# Altium schematic sheet Block.SchDoc: Title
size A3; Date: Date; CompanyName: Integrated Micro-Electronics Bulgaria; Organization: Design & Development Department; Address1: Drawing Type; Address2: Address 1; Address3: Address 2; Address4: Address 3; DocumentNumber: 730xxx; Revision: 01; SheetNumber: 1; SheetTotal: 1; PageSetup: Record=PageOptions|CenterHorizontal=True|CenterVertical=True|PrintScale=0.70|XCorrection=1.00|YCorrection=1.00|PrintKind=2|BorderSize=5000000|LeftOffset=0|BottomOffset=0|Orientation=2|PaperLength=1000|PaperWidth=1000|Scale=100|PaperSource=7|PrintQuality=-4|MediaType=1|DitherType=10|PaperKind=A4|PrintScaleMode=1; SheetSize: A3; Time: Time; ModifiedDate: Mod. Date
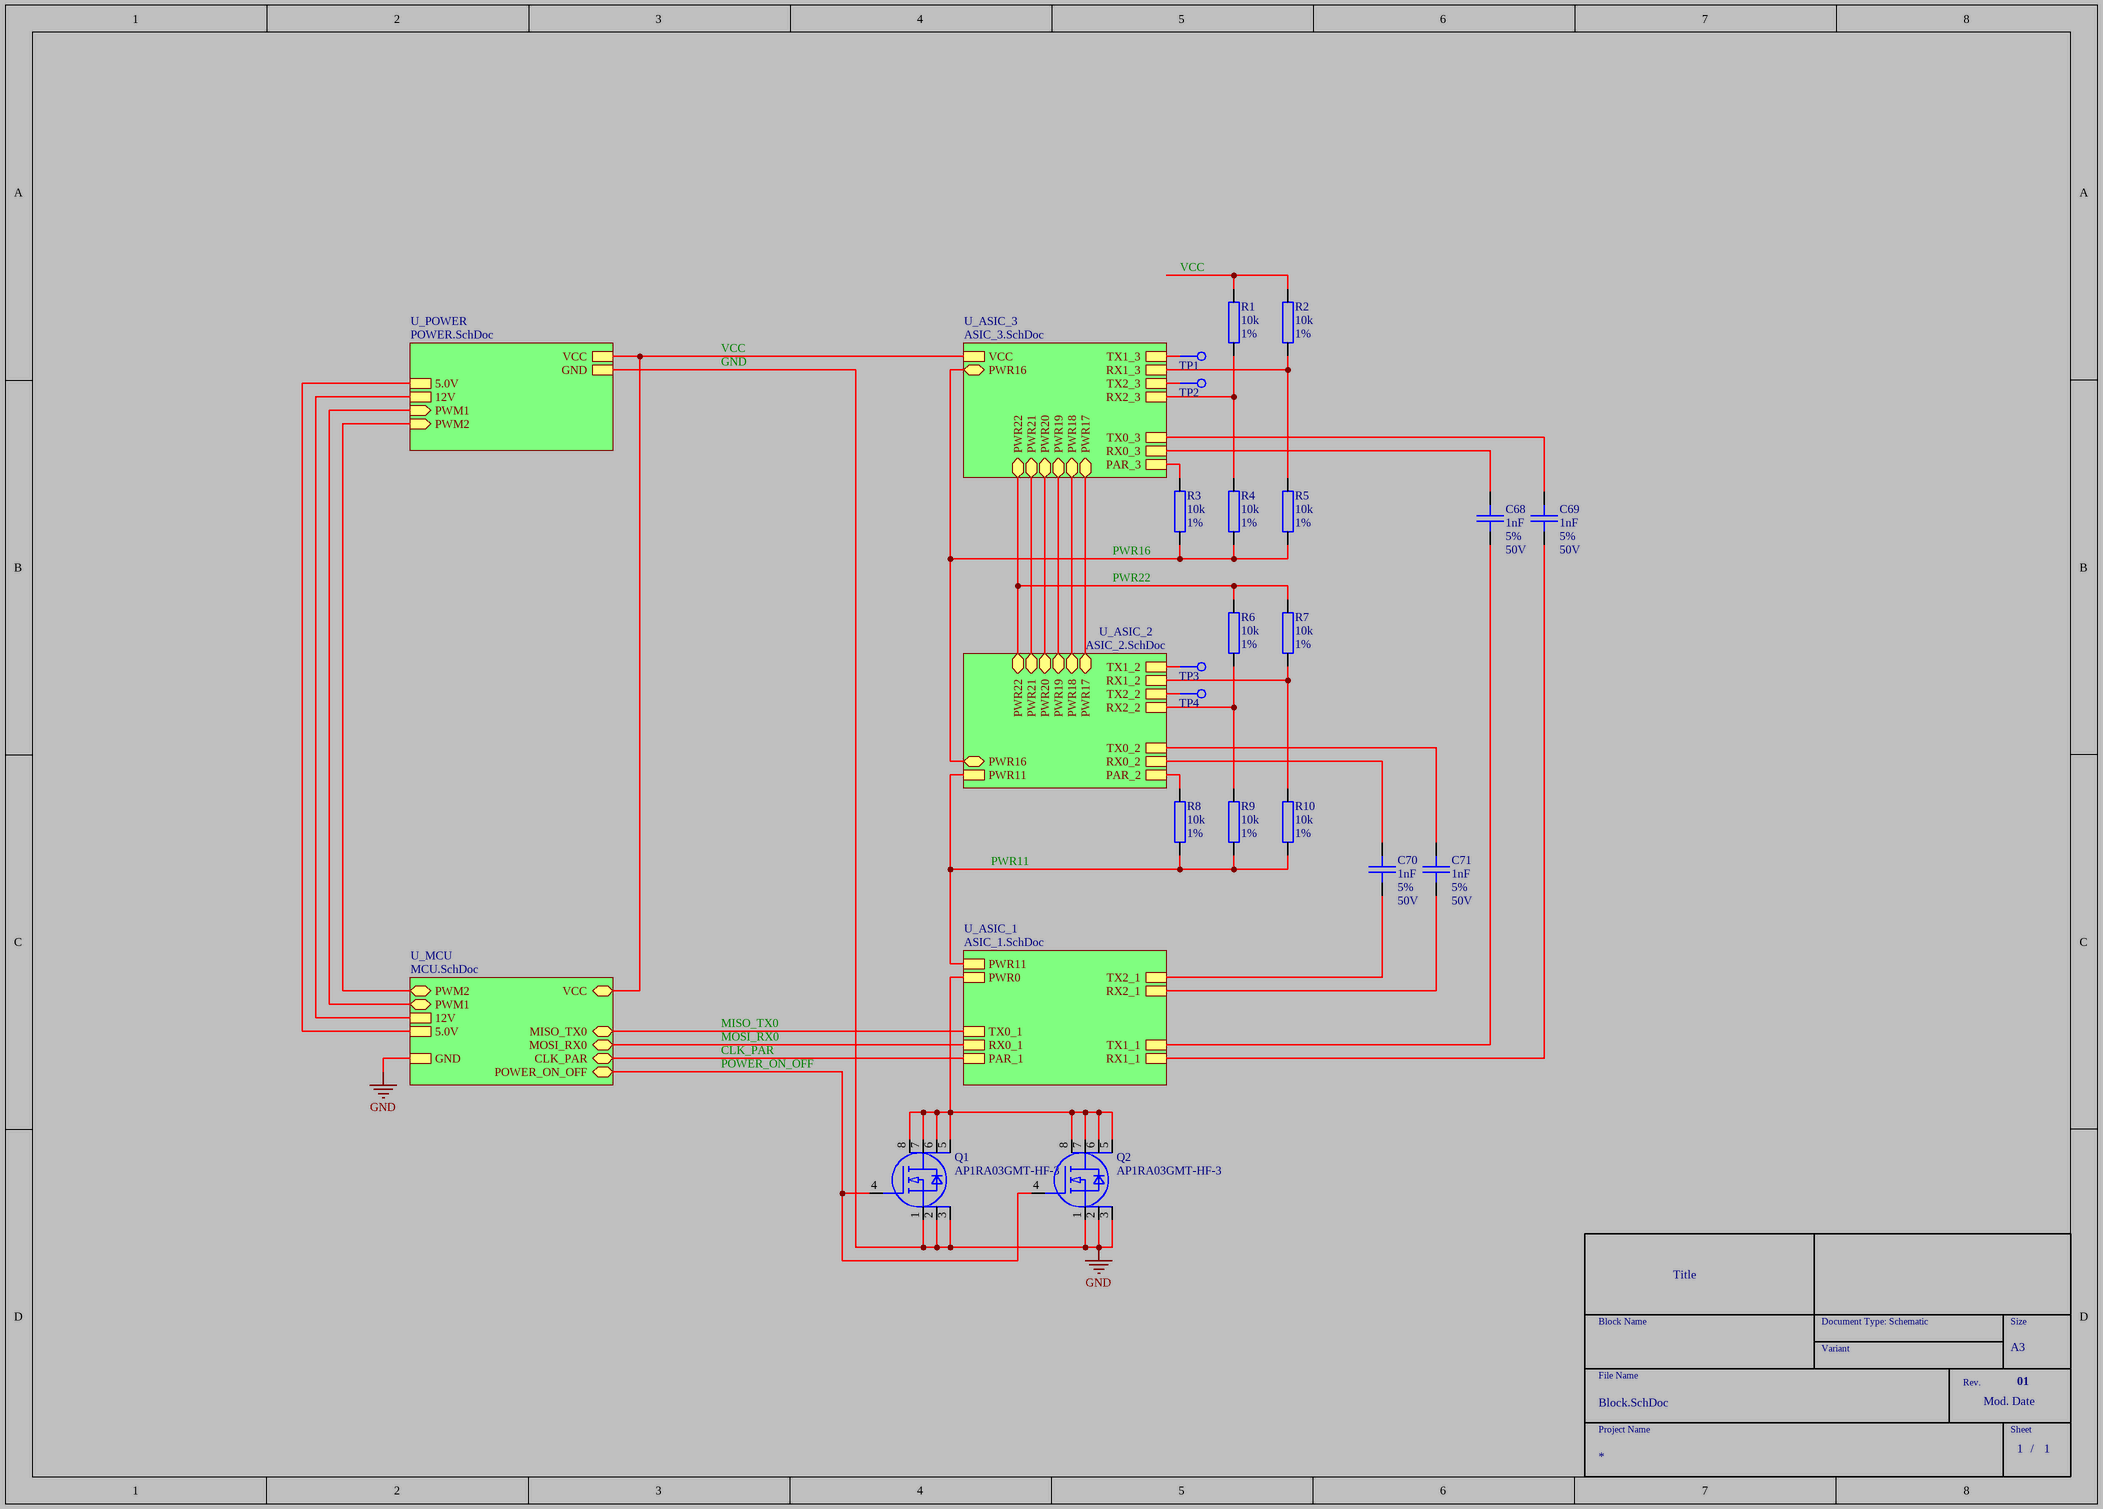
[diagram p0: Block.SchDoc]

## Parts
C68  DB_VALUE: 1nF  DB_TOLERANCE: 5%  DB_VOLTAGE: 50V  [SMD_0603_CAPC1608X95N]  (hidden comment: C)
C69  DB_VALUE: 1nF  DB_TOLERANCE: 5%  DB_VOLTAGE: 50V  [SMD_0603_CAPC1608X95N]  (hidden comment: C)
C70  DB_VALUE: 1nF  DB_TOLERANCE: 5%  DB_VOLTAGE: 50V  [SMD_0603_CAPC1608X95N]  (hidden comment: C)
C71  DB_VALUE: 1nF  DB_TOLERANCE: 5%  DB_VOLTAGE: 50V  [SMD_0603_CAPC1608X95N]  (hidden comment: C)
Q1  DB_VALUE: AP1RA03GMT-HF-3  [SMD_SOIC127P600X110-9AN]  (hidden comment: MOS_N_D1_S1S2S3G4D5D6D7D8)
Q2  DB_VALUE: AP1RA03GMT-HF-3  [SMD_SOIC127P600X110-9AN]  (hidden comment: MOS_N_D1_S1S2S3G4D5D6D7D8)
R1  DB_VALUE: 10k  DB_TOLERANCE: 1%  [SMD_0603_RESC1608X55N]  (hidden comment: R)
R2  DB_VALUE: 10k  DB_TOLERANCE: 1%  [SMD_0603_RESC1608X55N]  (hidden comment: R)
R3  DB_VALUE: 10k  DB_TOLERANCE: 1%  [SMD_0603_RESC1608X55N]  (hidden comment: R)
R4  DB_VALUE: 10k  DB_TOLERANCE: 1%  [SMD_0603_RESC1608X55N]  (hidden comment: R)
R5  DB_VALUE: 10k  DB_TOLERANCE: 1%  [SMD_0603_RESC1608X55N]  (hidden comment: R)
R6  DB_VALUE: 10k  DB_TOLERANCE: 1%  [SMD_0603_RESC1608X55N]  (hidden comment: R)
R7  DB_VALUE: 10k  DB_TOLERANCE: 1%  [SMD_0603_RESC1608X55N]  (hidden comment: R)
R8  DB_VALUE: 10k  DB_TOLERANCE: 1%  [SMD_0603_RESC1608X55N]  (hidden comment: R)
R9  DB_VALUE: 10k  DB_TOLERANCE: 1%  [SMD_0603_RESC1608X55N]  (hidden comment: R)
R10  DB_VALUE: 10k  DB_TOLERANCE: 1%  [SMD_0603_RESC1608X55N]  (hidden comment: R)
TP1  TEST_POINT_1  [SMD_TP_100-254]  (value not drawn)
TP2  TEST_POINT_1  [SMD_TP_100-254]  (value not drawn)
TP3  TEST_POINT_1  [SMD_TP_100-254]  (value not drawn)
TP4  TEST_POINT_1  [SMD_TP_100-254]  (value not drawn)

## Sub-sheets
U_ASIC_1 = ASIC_1.SchDoc: PWR11, PWR0, PAR_1, TX0_1, RX0_1, TX1_1, RX1_1, TX2_1, RX2_1
U_ASIC_2 = ASIC_2.SchDoc: PWR11, PAR_2, TX0_2, RX0_2, TX1_2, RX1_2, TX2_2, RX2_2, PWR16, PWR22, PWR17, PWR18, PWR19, PWR20, PWR21
U_ASIC_3 = ASIC_3.SchDoc: VCC, PAR_3, TX0_3, RX0_3, TX1_3, RX1_3, TX2_3, RX2_3, PWR16, PWR17, PWR18, PWR19, PWR20, PWR21, PWR22
U_MCU = MCU.SchDoc: GND, 12V, 5.0V, MOSI_RX0, MISO_TX0, CLK_PAR, POWER_ON_OFF, PWM1, PWM2, VCC
U_POWER = POWER.SchDoc: VCC, GND, 5.0V, 12V, PWM1 (in), PWM2 (in)

## Nets
GND: Q1.1(S) Q1.2(S) Q1.3(S) Q2.1(S) Q2.2(S) Q2.3(S) ; sheet U_MCU/GND, sheet U_POWER/GND
CLK_PAR: sheet U_MCU/CLK_PAR, sheet U_ASIC_1/PAR_1
MISO_TX0: sheet U_MCU/MISO_TX0, sheet U_ASIC_1/TX0_1
MOSI_RX0: sheet U_MCU/MOSI_RX0, sheet U_ASIC_1/RX0_1
POWER_ON_OFF: Q1.4(G) Q2.4(G) ; sheet U_MCU/POWER_ON_OFF
PWR11: R8.2 R9.2 R10.2 ; sheet U_ASIC_1/PWR11, sheet U_ASIC_2/PWR11
PWR16: R3.2 R4.2 R5.2 ; sheet U_ASIC_2/PWR16, sheet U_ASIC_3/PWR16
PWR22: R6.2 R7.2 ; sheet U_ASIC_2/PWR22, sheet U_ASIC_3/PWR22
VCC: R1.2 R2.2 ; sheet U_MCU/VCC, sheet U_ASIC_3/VCC, sheet U_POWER/VCC
NetC68_1: C68.1 ; sheet U_ASIC_3/RX0_3
NetC68_2: C68.2 ; sheet U_ASIC_1/TX1_1
NetC69_1: C69.1 ; sheet U_ASIC_3/TX0_3
NetC69_2: C69.2 ; sheet U_ASIC_1/RX1_1
NetC70_1: C70.1 ; sheet U_ASIC_2/RX0_2
NetC70_2: C70.2 ; sheet U_ASIC_1/TX2_1
NetC71_1: C71.1 ; sheet U_ASIC_2/TX0_2
NetC71_2: C71.2 ; sheet U_ASIC_1/RX2_1
NetQ1_5: Q1.5(D) Q1.6(D) Q1.7(D) Q1.8(D) Q2.5(D) Q2.6(D) Q2.7(D) Q2.8(D) ; sheet U_ASIC_1/PWR0
NetR1_1: R1.1 R4.1 ; sheet U_ASIC_3/RX2_3
NetR2_1: R2.1 R5.1 ; sheet U_ASIC_3/RX1_3
NetR3_1: R3.1 ; sheet U_ASIC_3/PAR_3
NetR6_1: R6.1 R9.1 ; sheet U_ASIC_2/RX2_2
NetR7_1: R7.1 R10.1 ; sheet U_ASIC_2/RX1_2
NetR8_1: R8.1 ; sheet U_ASIC_2/PAR_2
NetTP1_1: TP1.1 ; sheet U_ASIC_3/TX1_3
NetTP2_1: TP2.1 ; sheet U_ASIC_3/TX2_3
NetTP3_1: TP3.1 ; sheet U_ASIC_2/TX1_2
NetTP4_1: TP4.1 ; sheet U_ASIC_2/TX2_2
(unnamed): sheet U_MCU/12V, sheet U_POWER/12V
(unnamed): sheet U_MCU/5.0V, sheet U_POWER/5.0V
(unnamed): sheet U_MCU/PWM1, sheet U_POWER/PWM1
(unnamed): sheet U_MCU/PWM2, sheet U_POWER/PWM2
(unnamed): sheet U_ASIC_2/PWR17, sheet U_ASIC_3/PWR17
(unnamed): sheet U_ASIC_2/PWR18, sheet U_ASIC_3/PWR18
(unnamed): sheet U_ASIC_2/PWR19, sheet U_ASIC_3/PWR19
(unnamed): sheet U_ASIC_2/PWR20, sheet U_ASIC_3/PWR20
(unnamed): sheet U_ASIC_2/PWR21, sheet U_ASIC_3/PWR21

## Notes on the sheet
- Block Name
- Document Type: Schematic
- Size
- File Name
- Variant
- Rev.
- Project Name
- Sheet
- /

## Library data of the parts
C68-C71 = CAP000020649: DB_PART_TYPE: Ceramic_SMD\Open_Mode_X7R; DB_MANUFACTURER_PART: KEMET    C0603F102J5RAC; NOTE: <NOTE>; DB_T_RANGE: -55 to 125; DB_PACKAGE: 0603; DB_DESCRIPTION: C X7R 1nF 5% 50V 0603; DB_STATUS: NEW; DB_PART_NUMBER: CAP000020649; DB_PCB_DEVICE: SMD_0603_CAPC1608X95N; DB_APPROVED_ON: 09.10.2010; DB_DATASHEET: http://john.epiqdesign.com/projects/CIS_Datasheets/F3102_CE_Kemet.pdf?rev=92&sc=0
Q1 Q2 = TRA000001604: DB_PART_TYPE: MOSFET\N_Channel; DB_MANUFACTURER_PART: ADVANCED POWER ELECTRONICS CORP      AP1RA03GMT-HF-3; NOTE: <NOTE>; DB_T_RANGE: -55 to 150; DB_VOLTAGE: 30V; DB_CURRENT: 185A; DB_PACKAGE: PQFN 5x6B; DB_DESCRIPTION: TRANS AP1RA03GMT-HF-3 PQFN 5x6B; DB_APPROVED_BY: VSN; DB_STATUS: NEW; DB_PART_NUMBER: TRA000001604; DB_PCB_DEVICE: SMD_SOIC127P600X110-9AN; DB_APPROVED_ON: 07.05.2014 12:55:44; DB_DATASHEET: http://john.epiqdesign.com/projects/CIS_Datasheets/MOS_AP1RA03GMT-3.pdf?rev=1404&sc=0
R1-R10 = RES000008891: DB_PART_TYPE: SMD; DB_MANUFACTURER_PART: VISHAY    CRCW060310K0FKEA; NOTE: <NOTE>; DB_T_RANGE: -55 to 155; DB_POWER: 1/10W; DB_PACKAGE: 0603; DB_DESCRIPTION: R SMD 10k 1% 1/10W 0603; DB_CERTIFIED: AUT; DB_APPROVED_BY: VSN; DB_STATUS: NEW; R_BDS: R; DB_PART_NUMBER: RES000008891; DB_PCB_DEVICE: SMD_0603_RESC1608X55N; DB_APPROVED_ON: 25.01.2013 15:38:58; DB_DATASHEET: http://john.epiqdesign.com/projects/CIS_Datasheets/Standard_Thick_Film_Chip_Resistors_AEC_Vishay.pdf?rev=362&sc=0
TP1-TP4 = TPO000000001: DB_PART_TYPE: Test Point; DB_VALUE: 100_254; DB_DESCRIPTION: Test Point 100_254; DB_STATUS: NEW; DB_PART_NUMBER: TPO000000001; DB_DIAMETER: 100_254; DB_PCB_DEVICE: SMD_TP_100-254; DB_APPROVED_ON: 10.09.2010